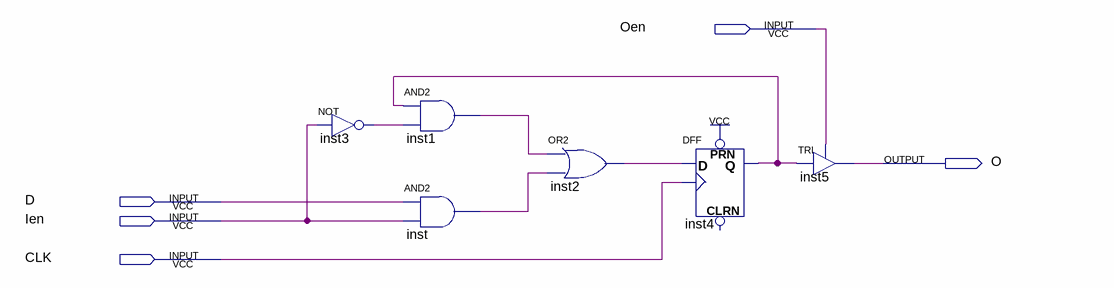
[diagram p0: schematic sheet]
// Quartus schematic reg_1bit_tristate.bdf as structural Verilog: 6 symbols, 5 pins
module reg_1bit_tristate (
  input  Oen,
  input  D,
  input  Ien,
  input  CLK,
  output O
);

  wire inst1_out, inst2_out, inst3_out, inst4_q, inst_out;

  not inst3 (inst3_out, Ien);
  and inst1 (inst1_out, inst4_q, inst3_out);
  and inst (inst_out, D, Ien);
  or inst2 (inst2_out, inst1_out, inst_out);
  DFF inst4 (.CLK(CLK), .D(inst2_out), .PRN(1'b1), .Q(inst4_q));  // open: CLRN
  TRI inst5 (.IN(inst4_q), .OE(Oen), .OUT(O));
endmodule
